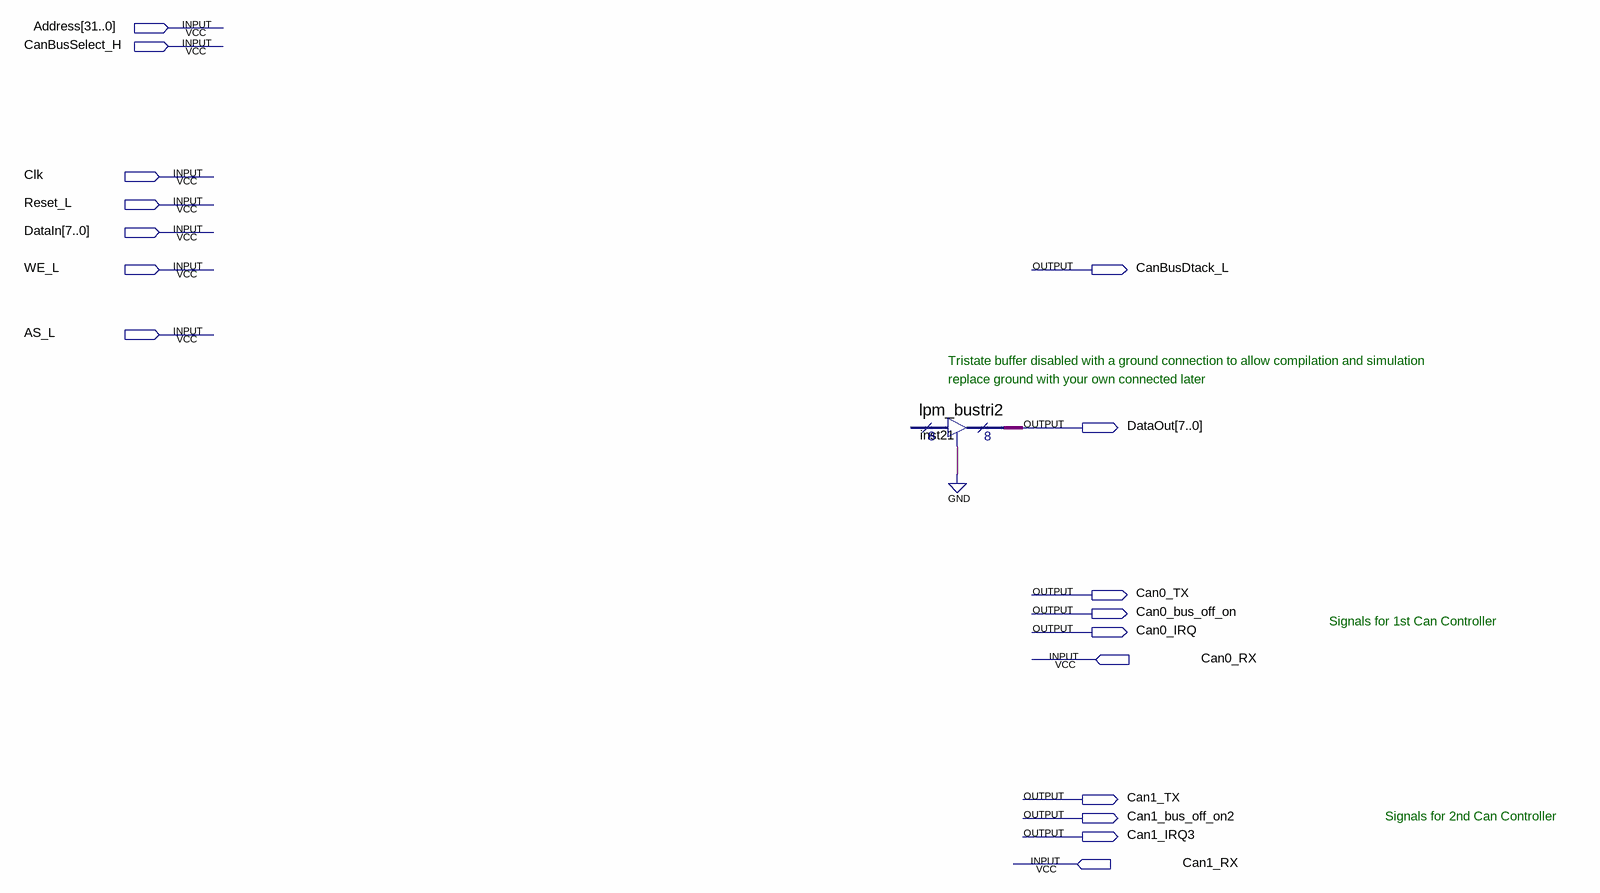
[diagram p0: schematic sheet]
// Quartus schematic CanBus.bdf as structural Verilog: 1 symbols, 17 pins
module CanBus (
  input  [31:0] Address,
  input  CanBusSelect_H,
  input  Clk,
  input  Reset_L,
  input  [7:0] DataIn,
  input  WE_L,
  input  AS_L,
  input  Can0_RX,
  input  Can1_RX,
  output CanBusDtack_L,
  output [7:0] DataOut,
  output Can0_TX,
  output Can0_bus_off_on,
  output Can0_IRQ,
  output Can1_TX,
  output Can1_bus_off_on2,
  output Can1_IRQ3
);

  lpm_bustri2 inst21 (.enabledt(1'b0), .tridata(DataOut));  // open: data

  // Notes on the sheet:
  //   Tristate buffer disabled with a ground connection to allow compilation and simulation
  //   replace ground with your own connected later
  //   Signals for 1st Can Controller
  //   Signals for 2nd Can Controller
endmodule
